# Altium schematic sheet Ethernet.SchDoc: RIO: ETHERNET
size Tabloid; Author: Set in Document Options » Parameters » Author + Contact info
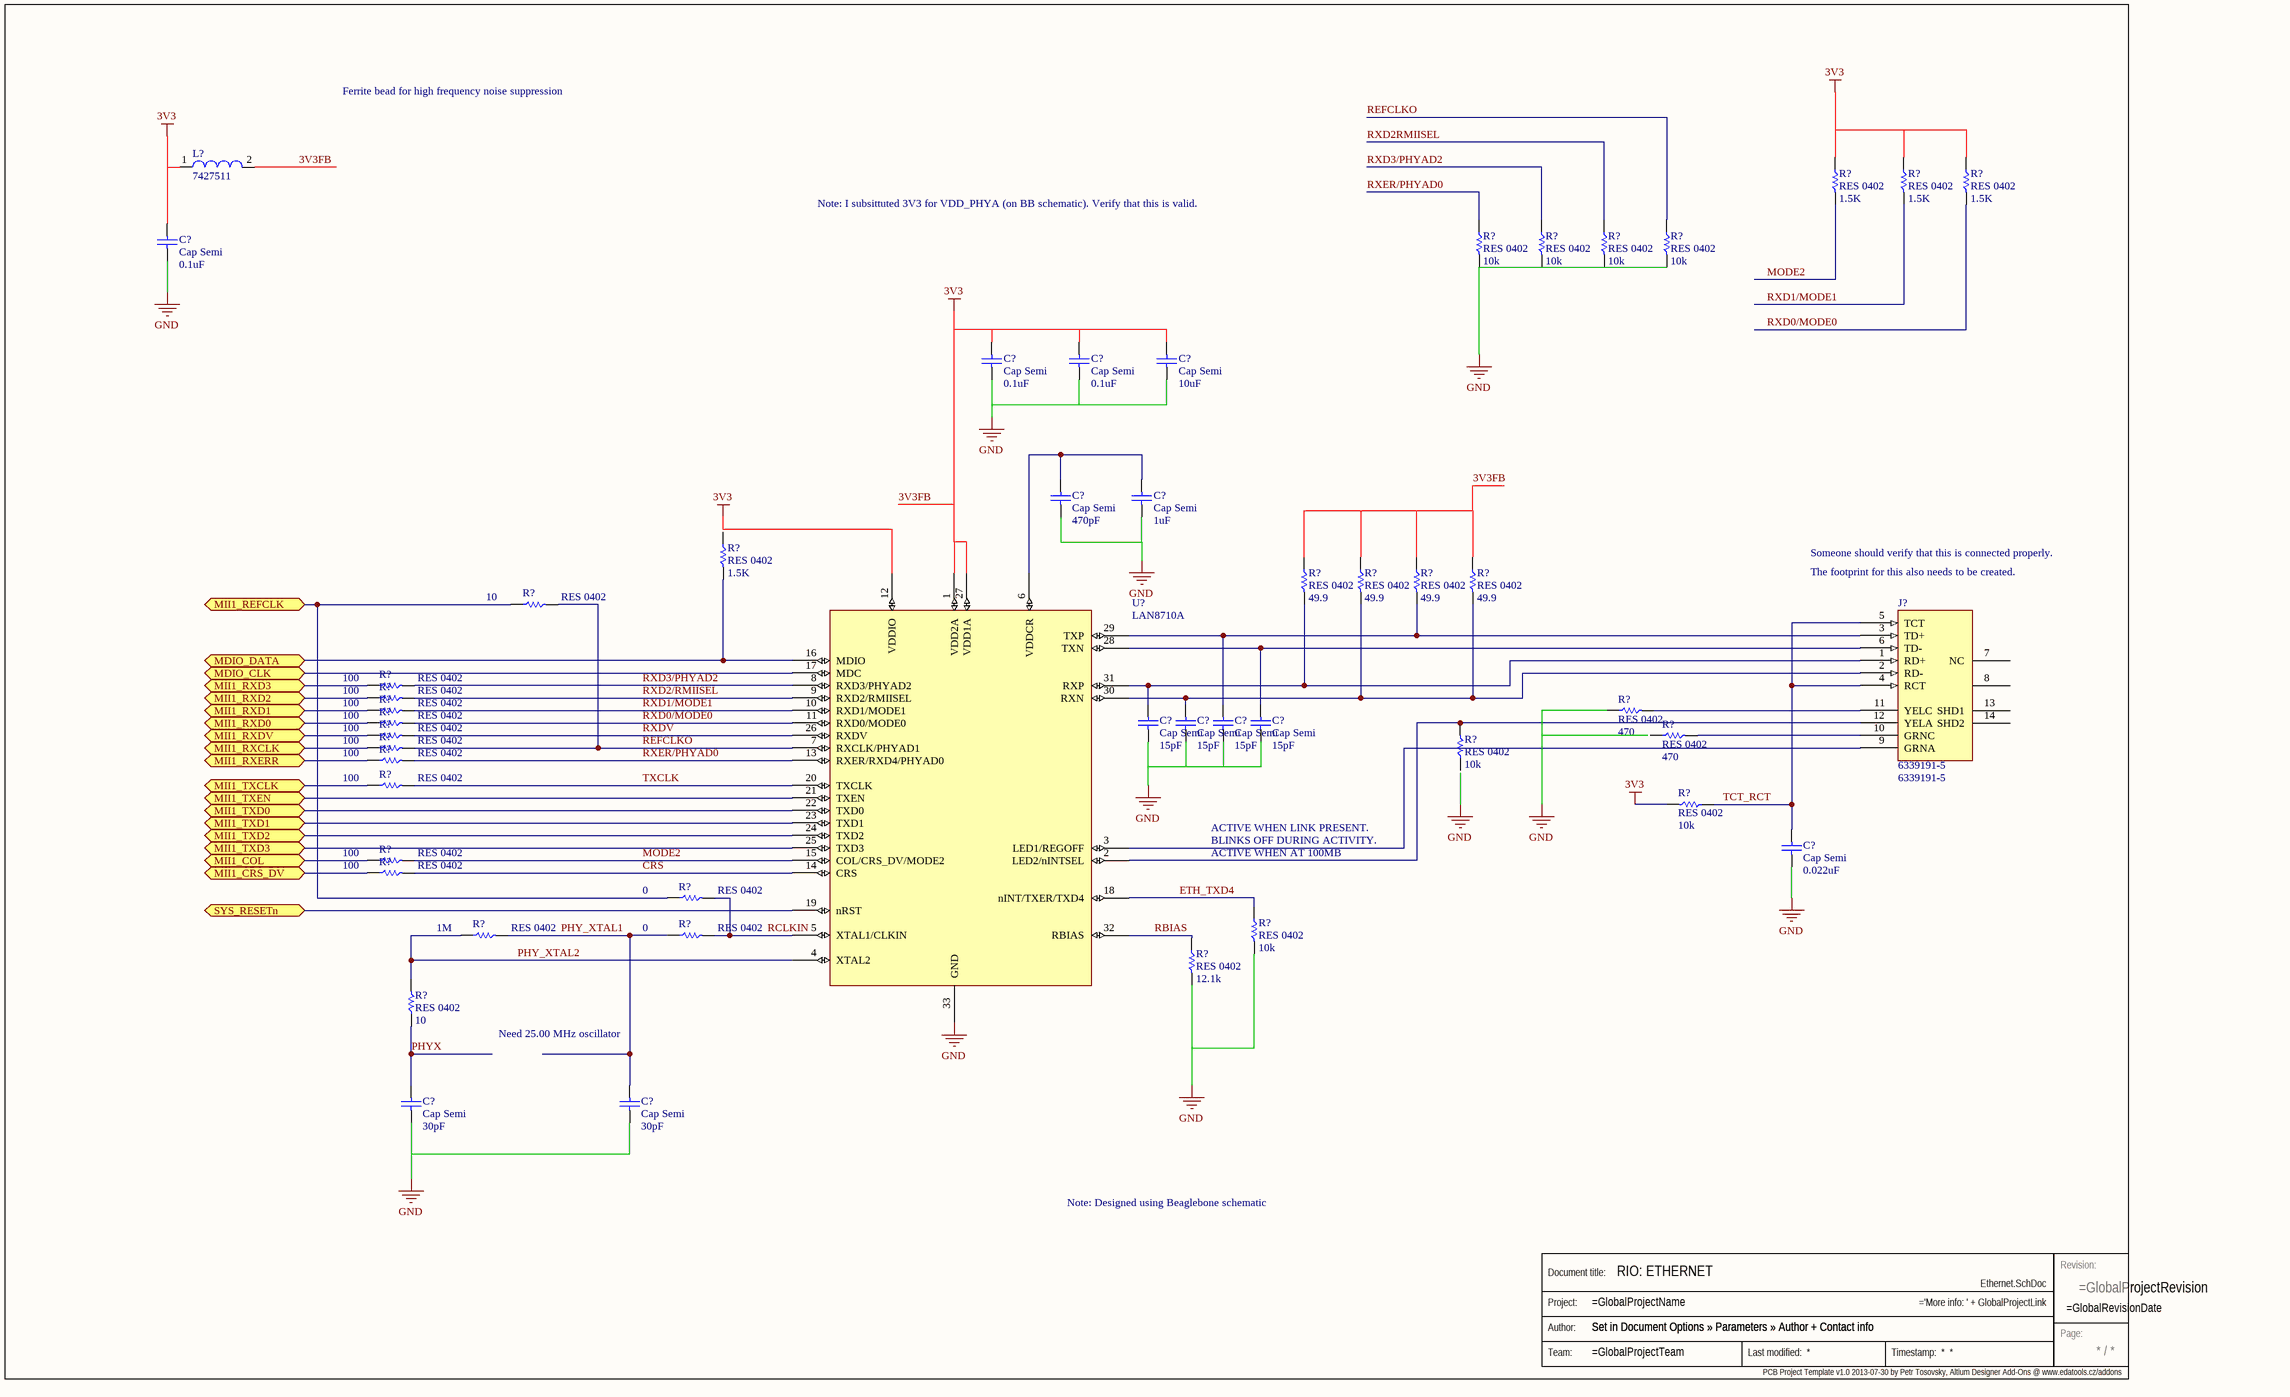
[diagram p0: Ethernet.SchDoc]

## Parts
(Parts that share a designator on the sheet are numbered #1, #2 ... from top to bottom, then left to right.)
C?#1  Cap Semi  value 0.1uF  [0402]
C?#2  Cap Semi  value 0.1uF  [0402]
C?#3  Cap Semi  value 0.1uF  [0402]
C?#4  Cap Semi  value 10uF  [0402]
C?#5  Cap Semi  value 470pF  [0402]
C?#6  Cap Semi  value 1uF  [0402]
C?#7  Cap Semi  value 15pF  [0402]
C?#8  Cap Semi  value 15pF  [0402]
C?#9  Cap Semi  value 15pF  [0402]
C?#10  Cap Semi  value 15pF  [0402]
C?#11  Cap Semi  value 0.022uF  [0402]
C?#12  Cap Semi  value 30pF  [0402]
C?#13  Cap Semi  value 30pF  [0402]
J?  6339191-5  [Ethernet connector]
L?  7427511  [WE-SUKW-7427511]
R?#1  RES 0402  Value (Ohms): 1.5K  [RES 0402]
R?#2  RES 0402  Value (Ohms): 1.5K  [RES 0402]
R?#3  RES 0402  Value (Ohms): 1.5K  [RES 0402]
R?#4  RES 0402  Value (Ohms): 10k  [RES 0402]
R?#5  RES 0402  Value (Ohms): 10k  [RES 0402]
R?#6  RES 0402  Value (Ohms): 10k  [RES 0402]
R?#7  RES 0402  Value (Ohms): 10k  [RES 0402]
R?#8  RES 0402  Value (Ohms): 1.5K  [RES 0402]
R?#9  RES 0402  Value (Ohms): 10  [RES 0402]
R?#10  RES 0402  Value (Ohms): 49.9  [RES 0402]
R?#11  RES 0402  Value (Ohms): 49.9  [RES 0402]
R?#12  RES 0402  Value (Ohms): 49.9  [RES 0402]
R?#13  RES 0402  Value (Ohms): 49.9  [RES 0402]
R?#14  RES 0402  Value (Ohms): 100  [RES 0402]
R?#15  RES 0402  Value (Ohms): 100  [RES 0402]
R?#16  RES 0402  Value (Ohms): 100  [RES 0402]
R?#17  RES 0402  Value (Ohms): 470  [RES 0402]
R?#18  RES 0402  Value (Ohms): 100  [RES 0402]
R?#19  RES 0402  Value (Ohms): 10k  [RES 0402]
R?#20  RES 0402  Value (Ohms): 100  [RES 0402]
R?#21  RES 0402  Value (Ohms): 470  [RES 0402]
R?#22  RES 0402  Value (Ohms): 100  [RES 0402]
R?#23  RES 0402  Value (Ohms): 100  [RES 0402]
R?#24  RES 0402  Value (Ohms): 100  [RES 0402]
R?#25  RES 0402  Value (Ohms): 10k  [RES 0402]
R?#26  RES 0402  Value (Ohms): 100  [RES 0402]
R?#27  RES 0402  Value (Ohms): 100  [RES 0402]
R?#28  RES 0402  Value (Ohms): 0  [RES 0402]
R?#29  RES 0402  Value (Ohms): 1M  [RES 0402]
R?#30  RES 0402  Value (Ohms): 0  [RES 0402]
R?#31  RES 0402  Value (Ohms): 10k  [RES 0402]
R?#32  RES 0402  Value (Ohms): 10  [RES 0402]
R?#33  RES 0402  Value (Ohms): 12.1k  [RES 0402]
Stamp  Stamp  (value not drawn)  (graphical)
U?  LAN8710A  [QFN-32_UH-L]

## Ports
MDIO_CLK, MDIO_DATA, MII1_COL, MII1_CRS_DV, MII1_REFCLK, MII1_RXCLK, MII1_RXD0, MII1_RXD1, MII1_RXD2, MII1_RXD3, MII1_RXDV, MII1_RXERR, MII1_TXCLK, MII1_TXD0, MII1_TXD1, MII1_TXD2, MII1_TXD3, MII1_TXEN, SYS_RESETn

## Nets
3V3: R?#25.1
GND: U?.33(GND)
CRS: R?#27.1 U?.14(CRS)
ETH_TXD4: R?#31.2 U?.18(nINT/TXER/TXD4)
MDIO_CLK: U?.17(MDC) ; port MDIO_CLK
MDIO_DATA: R?#8.1 U?.16(MDIO) ; port MDIO_DATA
MII1_COL: R?#26.2 ; port MII1_COL
MII1_CRS_DV: R?#27.2 ; port MII1_CRS_DV
MII1_REFCLK: R?#9.2 R?#28.2 ; port MII1_REFCLK
MII1_RXCLK: R?#22.2 ; port MII1_RXCLK
MII1_RXD0: R?#18.2 ; port MII1_RXD0
MII1_RXD1: R?#16.2 ; port MII1_RXD1
MII1_RXD2: R?#15.2 ; port MII1_RXD2
MII1_RXD3: R?#14.2 ; port MII1_RXD3
MII1_RXDV: R?#20.2 ; port MII1_RXDV
MII1_RXERR: R?#23.2 ; port MII1_RXERR
MII1_TXCLK: R?#24.2 ; port MII1_TXCLK
MII1_TXD0: U?.22(TXD0) ; port MII1_TXD0
MII1_TXD1: U?.23(TXD1) ; port MII1_TXD1
MII1_TXD2: U?.24(TXD2) ; port MII1_TXD2
MII1_TXD3: U?.25(TXD3) ; port MII1_TXD3
MII1_TXEN: U?.21(TXEN) ; port MII1_TXEN
MODE2: R?#1.1 R?#26.1 U?.15(COL/CRS_DV/MODE2)
PHY_XTAL1: C?#13.2 R?#29.1 R?#30.2
PHY_XTAL2: R?#29.2 R?#32.1 U?.4(XTAL2)
PHYX: C?#12.2 R?#32.2
RBIAS: R?#33.2 U?.32(RBIAS)
RCLKIN: R?#28.1 R?#30.1 U?.5(XTAL1/CLKIN)
REFCLKO: R?#7.2 R?#9.1 R?#22.1 U?.7(RXCLK/PHYAD1)
RXD0/MODE0: R?#3.1 R?#18.1 U?.11(RXD0/MODE0)
RXD1/MODE1: R?#2.1 R?#16.1 U?.10(RXD1/MODE1)
RXD2/RMIISEL: R?#15.1 U?.9(RXD2/RMIISEL)
RXD2RMIISEL: R?#6.2
RXD3/PHYAD2: R?#5.2 R?#14.1 U?.8(RXD3/PHYAD2)
RXDV: R?#20.1 U?.26(RXDV)
RXER/PHYAD0: R?#4.2 R?#23.1 U?.13(RXER/RXD4/PHYAD0)
SYS_RESETn: U?.19(nRST) ; port SYS_RESETn
TCT_RCT: C?#11.2 J?.4(RCT) J?.5(TCT) R?#25.2
TXCLK: R?#24.1 U?.20(TXCLK)
NetC?#5_2: C?#5.2 C?#6.2 U?.6(VDDCR)
NetC?#7_2: C?#7.2 J?.1(RD+) R?#10.1 U?.31(RXP)
NetC?#8_2: C?#8.2 J?.2(RD-) R?#11.1 R?#13.1 U?.30(RXN)
NetC?#9_2: C?#9.2 J?.3(TD+) R?#12.1 U?.29(TXP)
NetC?#10_2: C?#10.2 J?.6(TD-) U?.28(TXN)
NetJ?_9: J?.9(GRNA) U?.3(LED1/REGOFF)
NetJ?_10: J?.10(GRNC) R?#21.1
NetJ?_11: J?.11(YELC) R?#17.1
NetJ?_12: J?.12(YELA) R?#19.1 U?.2(LED2/nINTSEL)

Not connected (* = marked no-connect by the designer): C?#1 1 2; C?#2 1 2; C?#3 1 2; C?#4 1 2; C?#5 1; C?#6 1; C?#7 1; C?#8 1; C?#9 1; C?#10 1; C?#11 1; C?#12 1; C?#13 1; J? 7(NC) 8 13(SHD1) 14(SHD2); L? 1 2; R?#1 2; R?#2 2; R?#3 2; R?#4 1; R?#5 1; R?#6 1; R?#7 1; R?#8 2; R?#10 2; R?#11 2; R?#12 2; R?#13 2; R?#17 2; R?#19 2; R?#21 2; R?#31 1; R?#33 1; U? 1(VDD2A) 12(VDDIO) 27(VDD1A)

## Buses and harness runs
bus 3V3FB

## Notes on the sheet
- Ferrite bead for high frequency noise suppression
- Note: I subsittuted 3V3 for VDD_PHYA (on BB schematic). Verify that this is valid.
- Someone should verify that this is connected properly.
- (near J?) The footprint for this also needs to be created.
- ACTIVE WHEN LINK PRESENT.
- ACTIVE WHEN AT 100MB
- BLINKS OFF DURING ACTIVITY.
- Need 25.00 MHz oscillator
- Note: Designed using Beaglebone schematic
- PCB Project Template v1.0 2013-07-30 by Petr Tosovsky, Altium Designer Add-Ons @ www.edatools.cz/addons <http://www.edatools.cz/addons>
- Labels drawn without touching a wire or pin: 3V3, GND
- (in symbol Stamp) Revision:; Document title:; Project:; Author:; Page:; Team:

## Library data of the parts
C?#1-C?#13 = Cap Semi: Capacitor (Semiconductor SIM Model); Published: 8-Jun-2000; LatestRevisionDate: 29-May-2009; LatestRevisionNote: IPC-7351 Footprint Added.; PackageReference: C1206; Publisher: Altium Limited; PackageDescription: Chip Capacitor
J? = 6339191-5: Ethernet Port; Manufacturer: TE Connectivity AMP Connectors; Digikey Link: https://www.digikey.com/product-detail/en/te-connectivity-amp-connectors/6339191-5/A109166CT-ND/4030384; Digikey P/N: A109166CT-ND; Manufacturer P/N: 6339191-5
L? = 7427511: EMI Suppression 5-Hole Ferrite Bead WE-SUKW, Z = 416 Ohm; Impedance: 416 Ohm; DatasheetVersion: ver 6, Jun - 2007; PackageReference: WE-SUKW-7427511; PackageDescription: Inductor, 2-Leads, Body 5.5 x 5.0 mm; PartNumber: 7427511; ComponentLink1Description: Manufacturer URL; ComponentLink1URL: http://www.we-online.com; ComponentLink2Description: Datasheet; ComponentLink2URL: http://www.we-online.de/katalog/media/pdf/7427511.pdf
U? = LAN8710A: Manufacturer: Microchip Technology; Digikey P/N: LAN8710AI-EZK-TR-ND; Footprint: QFC-32; Digikey Link: https://www.digikey.com/product-detail/en/microchip-technology/LAN8710AI-EZK-TR/LAN8710AI-EZK-TR-ND/3872108; Manufacturer P/N: LAN8710A
R?#1-R?#33 = RES 0402: PartNumber: *; Tolerance: *